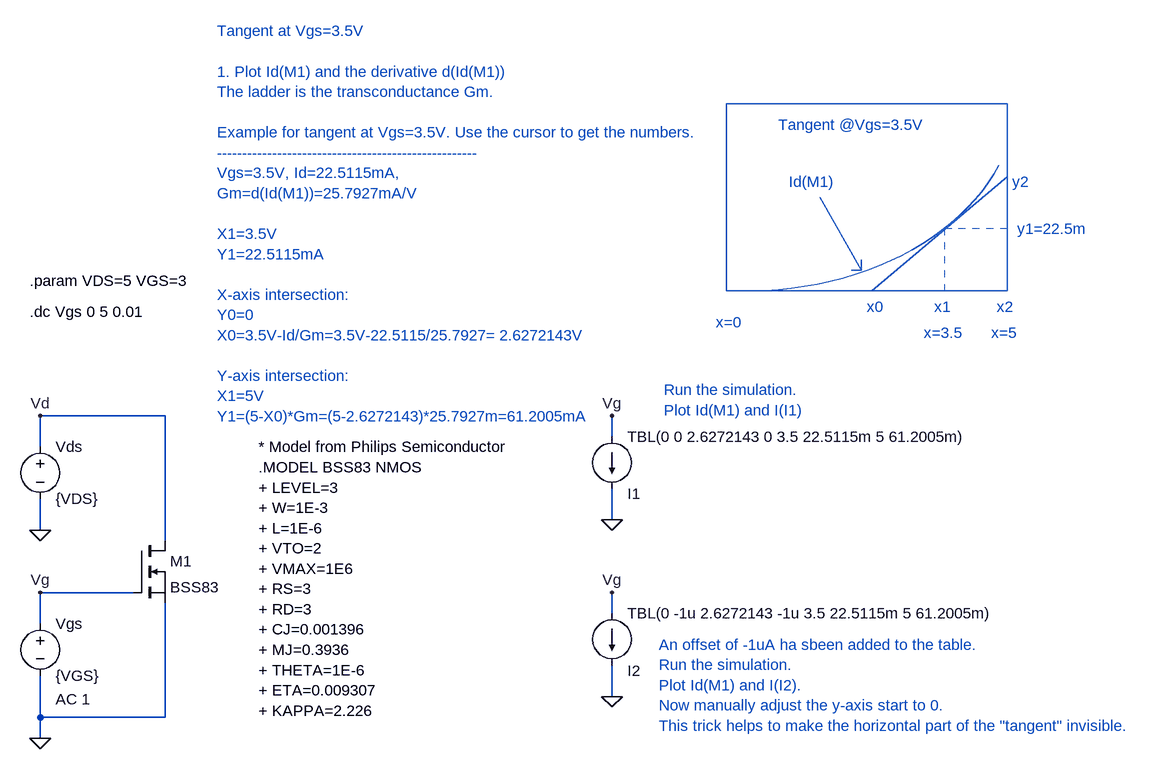
[diagram p0: schematic Tangent_demo.asc]
Tangent_demo.asc, the LTspice schematic file:
Version 4
SHEET 1 1964 968
WIRE 96 208 -96 208
WIRE 784 240 784 208
WIRE -96 256 -96 208
WIRE 784 368 784 320
WIRE -96 384 -96 336
WIRE 96 400 96 208
WIRE 48 480 -96 480
WIRE 784 512 784 480
WIRE -96 528 -96 480
WIRE 784 640 784 592
WIRE -96 672 -96 608
WIRE 96 672 96 496
WIRE 96 672 -96 672
WIRE -96 704 -96 672
FLAG -96 704 0
FLAG -96 384 0
FLAG -96 208 Vd
FLAG -96 480 Vg
FLAG 784 368 0
FLAG 784 208 Vg
FLAG 784 640 0
FLAG 784 480 Vg
SYMBOL voltage -96 512 R0
WINDOW 123 24 132 Left 0
WINDOW 39 0 0 Left 0
SYMATTR Value2 AC 1
SYMATTR InstName Vgs
SYMATTR Value {VGS}
SYMBOL voltage -96 240 R0
WINDOW 123 24 132 Left 0
WINDOW 39 0 0 Left 0
SYMATTR InstName Vds
SYMATTR Value {VDS}
SYMBOL nmos 48 400 R0
SYMATTR InstName M1
SYMATTR Value BSS83
SYMBOL current 784 240 R0
WINDOW 0 24 88 Left 0
WINDOW 3 24 0 Left 0
WINDOW 123 0 0 Left 0
WINDOW 39 0 0 Left 0
SYMATTR InstName I1
SYMATTR Value TBL(0 0 2.6272143 0 3.5 22.5115m 5 61.2005m)
SYMBOL current 784 512 R0
WINDOW 0 24 88 Left 0
WINDOW 3 24 0 Left 0
WINDOW 123 0 0 Left 0
WINDOW 39 0 0 Left 0
SYMATTR InstName I2
SYMATTR Value TBL(0 -1u 2.6272143 -1u 3.5 22.5115m 5 61.2005m)
TEXT -112 0 Left 0 !.param VDS=5 VGS=3
TEXT 240 256 Left 0 !* Model from Philips Semiconductor\n.MODEL BSS83 NMOS\n+ LEVEL=3\n+ W=1E-3\n+ L=1E-6\n+ VTO=2\n+ VMAX=1E6\n+ RS=3\n+ RD=3\n+ CJ=0.001396\n+ MJ=0.3936\n+ THETA=1E-6\n+ ETA=0.009307\n+ KAPPA=2.226
TEXT -112 48 Left 0 !.dc Vgs 0 5 0.01
TEXT 176 -384 Left 0 ;Tangent at Vgs=3.5V\n \n1. Plot Id(M1) and the derivative d(Id(M1))\nThe ladder is the transconductance Gm.\n \nExample for tangent at Vgs=3.5V. Use the cursor to get the numbers.\n----------------------------------------------------\nVgs=3.5V, Id=22.5115mA, \nGm=d(Id(M1))=25.7927mA/V \n \nX1=3.5V\nY1=22.5115mA\n \nX-axis intersection:\nY0=0\nX0=3.5V-Id/Gm=3.5V-22.5115/25.7927= 2.6272143V\n \nY-axis intersection:\nX1=5V\nY1=(5-X0)*Gm=(5-2.6272143)*25.7927m=61.2005mA
TEXT 856 560 Left 0 ;An offset of -1uA ha sbeen added to the table.\nRun the simulation.\nPlot Id(M1) and I(I2).\nNow manually adjust the y-axis start to 0.\nThis trick helps to make the horizontal part of the "tangent" invisible.
TEXT 864 168 Left 0 ;Run the simulation.\nPlot Id(M1) and I(I1)
TEXT 1176 40 Left 0 ;x0
TEXT 1280 40 Left 0 ;x1
TEXT 1376 40 Left 0 ;x2
TEXT 1264 80 Left 0 ;x=3.5
TEXT 1368 80 Left 0 ;x=5
TEXT 944 64 Left 0 ;x=0
TEXT 1056 -152 Left 0 ;Id(M1)
TEXT 1408 -80 Left 0 ;y1=22.5m
TEXT 1400 -152 Left 0 ;y2
TEXT 1040 -240 Left 0 ;Tangent @Vgs=3.5V
LINE Normal 1184 16 1392 -160
LINE Normal 1168 -16 1104 -128
LINE Normal 1168 -32 1168 -16
LINE Normal 1152 -16 1168 -16
LINE Normal 1296 16 1296 -80 2
LINE Normal 1392 -80 1296 -80 2
LINE Normal 1392 -80 1392 -80 2
RECTANGLE Normal 1392 16 960 -272
ARC Normal 576 -592 1408 16 1003 173 1069 -266

The netlist it stands for:
* Tangent_demo.asc
Vgs Vg 0 {VGS} AC 1
Vds Vd 0 {VDS}
M1 Vd Vg 0 0 BSS83
I1 Vg 0 TBL(0 0 2.6272143 0 3.5 22.5115m 5 61.2005m)
I2 Vg 0 TBL(0 -1u 2.6272143 -1u 3.5 22.5115m 5 61.2005m)
.model NMOS NMOS
.model PMOS PMOS
.lib standard.mos
.param VDS=5 VGS=3
* Model from Philips Semiconductor
.MODEL BSS83 NMOS
+ LEVEL=3
+ W=1E-3
+ L=1E-6
+ VTO=2
+ VMAX=1E6
+ RS=3
+ RD=3
+ CJ=0.001396
+ MJ=0.3936
+ THETA=1E-6
+ ETA=0.009307
+ KAPPA=2.226
.dc Vgs 0 5 0.01
* Tangent at Vgs=3.5V
* 1. Plot Id(M1) and the derivative d(Id(M1))
* The ladder is the transconductance Gm.
* Example for tangent at Vgs=3.5V. Use the cursor to get the numbers.
* ----------------------------------------------------
* Vgs=3.5V, Id=22.5115mA,
* Gm=d(Id(M1))=25.7927mA/V
* X1=3.5V
* Y1=22.5115mA
* X-axis intersection:
* Y0=0
* X0=3.5V-Id/Gm=3.5V-22.5115/25.7927= 2.6272143V
* Y-axis intersection:
* X1=5V
* Y1=(5-X0)*Gm=(5-2.6272143)*25.7927m=61.2005mA
* An offset of -1uA ha sbeen added to the table.
* Run the simulation.
* Plot Id(M1) and I(I2).
* Now manually adjust the y-axis start to 0.
* This trick helps to make the horizontal part of the "tangent" invisible.
* Run the simulation.
* Plot Id(M1) and I(I1)
* x0
* x1
* x2
* x=3.5
* x=5
* x=0
* Id(M1)
* y1=22.5m
* y2
* Tangent @Vgs=3.5V
.backanno
.end